# EasyEDA schematic rtc-ds3231-easyeda.json
TITLE: DS3231 Low Power Breakout; REV: 1.0; Date: 2021-08-30; Sheet: 1/1; Drawn By: chrisb2
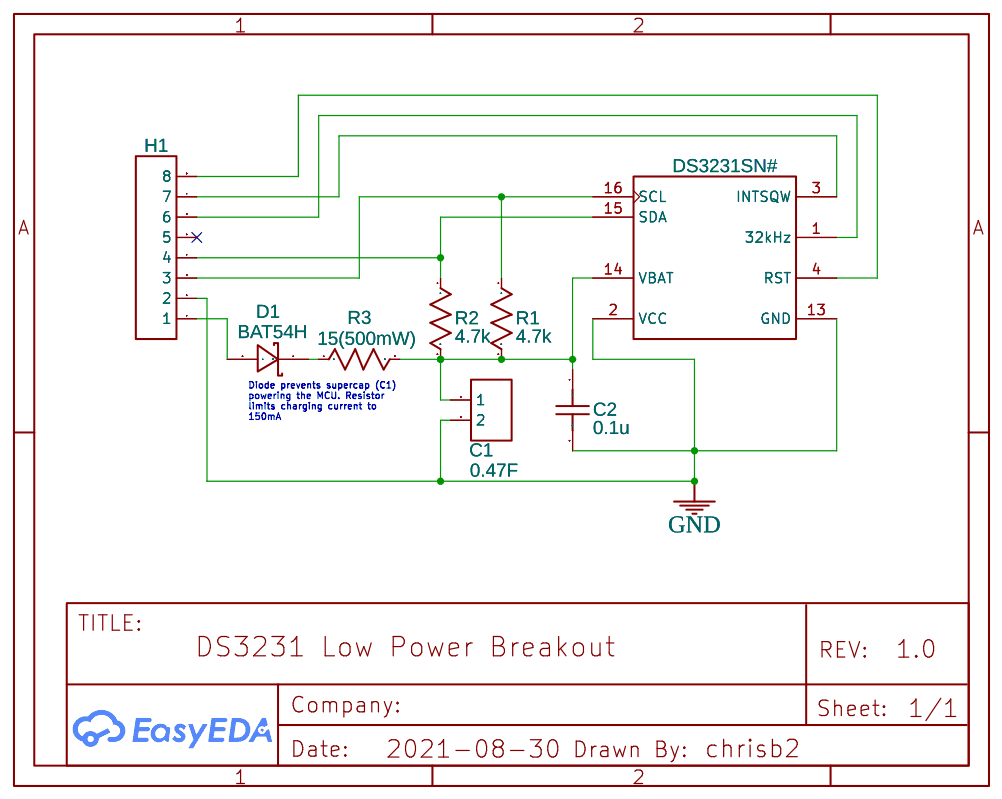
[diagram p0: schematic sheet]

## Parts
C1  0.47F  [HDR-M-2.54_1X2]
C2  0.1u  [C0805]
D1  BAT54H  [SOD-123FL_L3.0-W1.8-LS3.7-RD]
H1  HDR-F-2.54_1x8  [HDR-F-2.54_1X8]
R1  4.7k  [R0805]
R2  4.7k  [R0805]
R3  15(500mW)  [R1206]
U1  DS3231SN#  [SOIC-16_L10.3-W7.5-P1.27-LS10.3-BL]  (section 1)

## Library data of the parts
C1 = HDR-M-2.54_1x2: Supplier Part: C124375; Supplier: LCSC; Contributor: LCEDA_Lib
C2 = C_0805_US: Contributor: LCEDA_Lib
D1 = BAT54H,115: Supplier: LCSC; Supplier Part: C426769; Manufacturer: Nexperia; Contributor: LCSC; JLCPCB Part Class: Extended Part
H1 = HDR-F-2.54_1x8: Supplier Part: C225505; Supplier: LCSC; Contributor: LCEDA_Lib
R1 R2 = R_0805_US: Supplier Part: C441984; Supplier: LCSC; Contributor: LCEDA_Lib; Manufacturer Part: ERJP06F4701V; Manufacturer: PANASONIC
R3 = R_0805_US: Supplier Part: C304964; Supplier: LCSC; Contributor: LCEDA_Lib; Manufacturer Part: RTH06150JTP; Manufacturer: RALEC
U1 = DS3231SN#: tags: Clock; Supplier Part: C9866; Supplier: LCSC; Manufacturer: MAXIM; Manufacturer Part: DS3231SN; subpart_no: 1; image: http://image.lceda.cn/szlcsc/C9866.jpg; JLCPCB Part Class: Extended Part

## Nets
GND: C1.2 C2.2 H1.2 U1.2(VCC) U1.13(GND)
Net-(C1-1): C1.1 C2.1 R1.2 R2.2 R3.2 U1.14(VBAT)
Net-(D1-1): D1.1(C) R3.1
Net-(D1-2): D1.2(A) H1.1
Net-(H1-3): H1.3 R1.1 U1.16(SCL)
Net-(H1-4): H1.4 R2.1 U1.15(SDA)
Net-(H1-6): H1.6 U1.1(32kHz)
Net-(H1-7): H1.7 U1.3(INTSQW)
Net-(H1-8): H1.8 U1.4(RST)

Not connected (* = marked no-connect by the designer): H1 5*

## Notes on the sheet
- Diode prevents supercap (C1)
  powering the MCU. Resistor
  limits charging current to
  150mA
